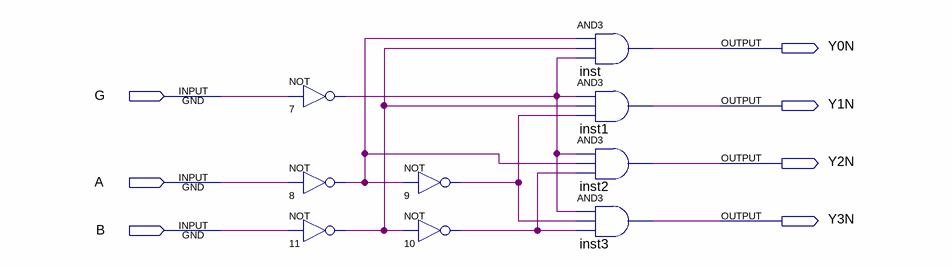
[diagram p0: schematic sheet]
// Quartus schematic DEC24.bdf as structural Verilog: 9 symbols, 7 pins
module DEC24 (
  input  G,
  input  A,
  input  B,
  output Y0N,
  output Y1N,
  output Y2N,
  output Y3N
);

  wire n7_out, n8_out, n9_out, n10_out, n11_out;

  not u_7 (n7_out, G);
  not u_8 (n8_out, A);
  not u_11 (n11_out, B);
  not u_9 (n9_out, n8_out);
  not u_10 (n10_out, n11_out);
  and inst (Y0N, n8_out, n11_out, n7_out);
  and inst1 (Y1N, n7_out, n11_out, n9_out);
  and inst2 (Y2N, n7_out, n8_out, n10_out);
  and inst3 (Y3N, n7_out, n9_out, n10_out);
endmodule
